# EasyEDA schematic SCH_HackClub-PCB-1_2024-05-19.json
TITLE: Sheet_1; REV: 1.0; Date: 2024-05-09; Sheet: 1/1; Drawn By: noahf15; Company: Your Company
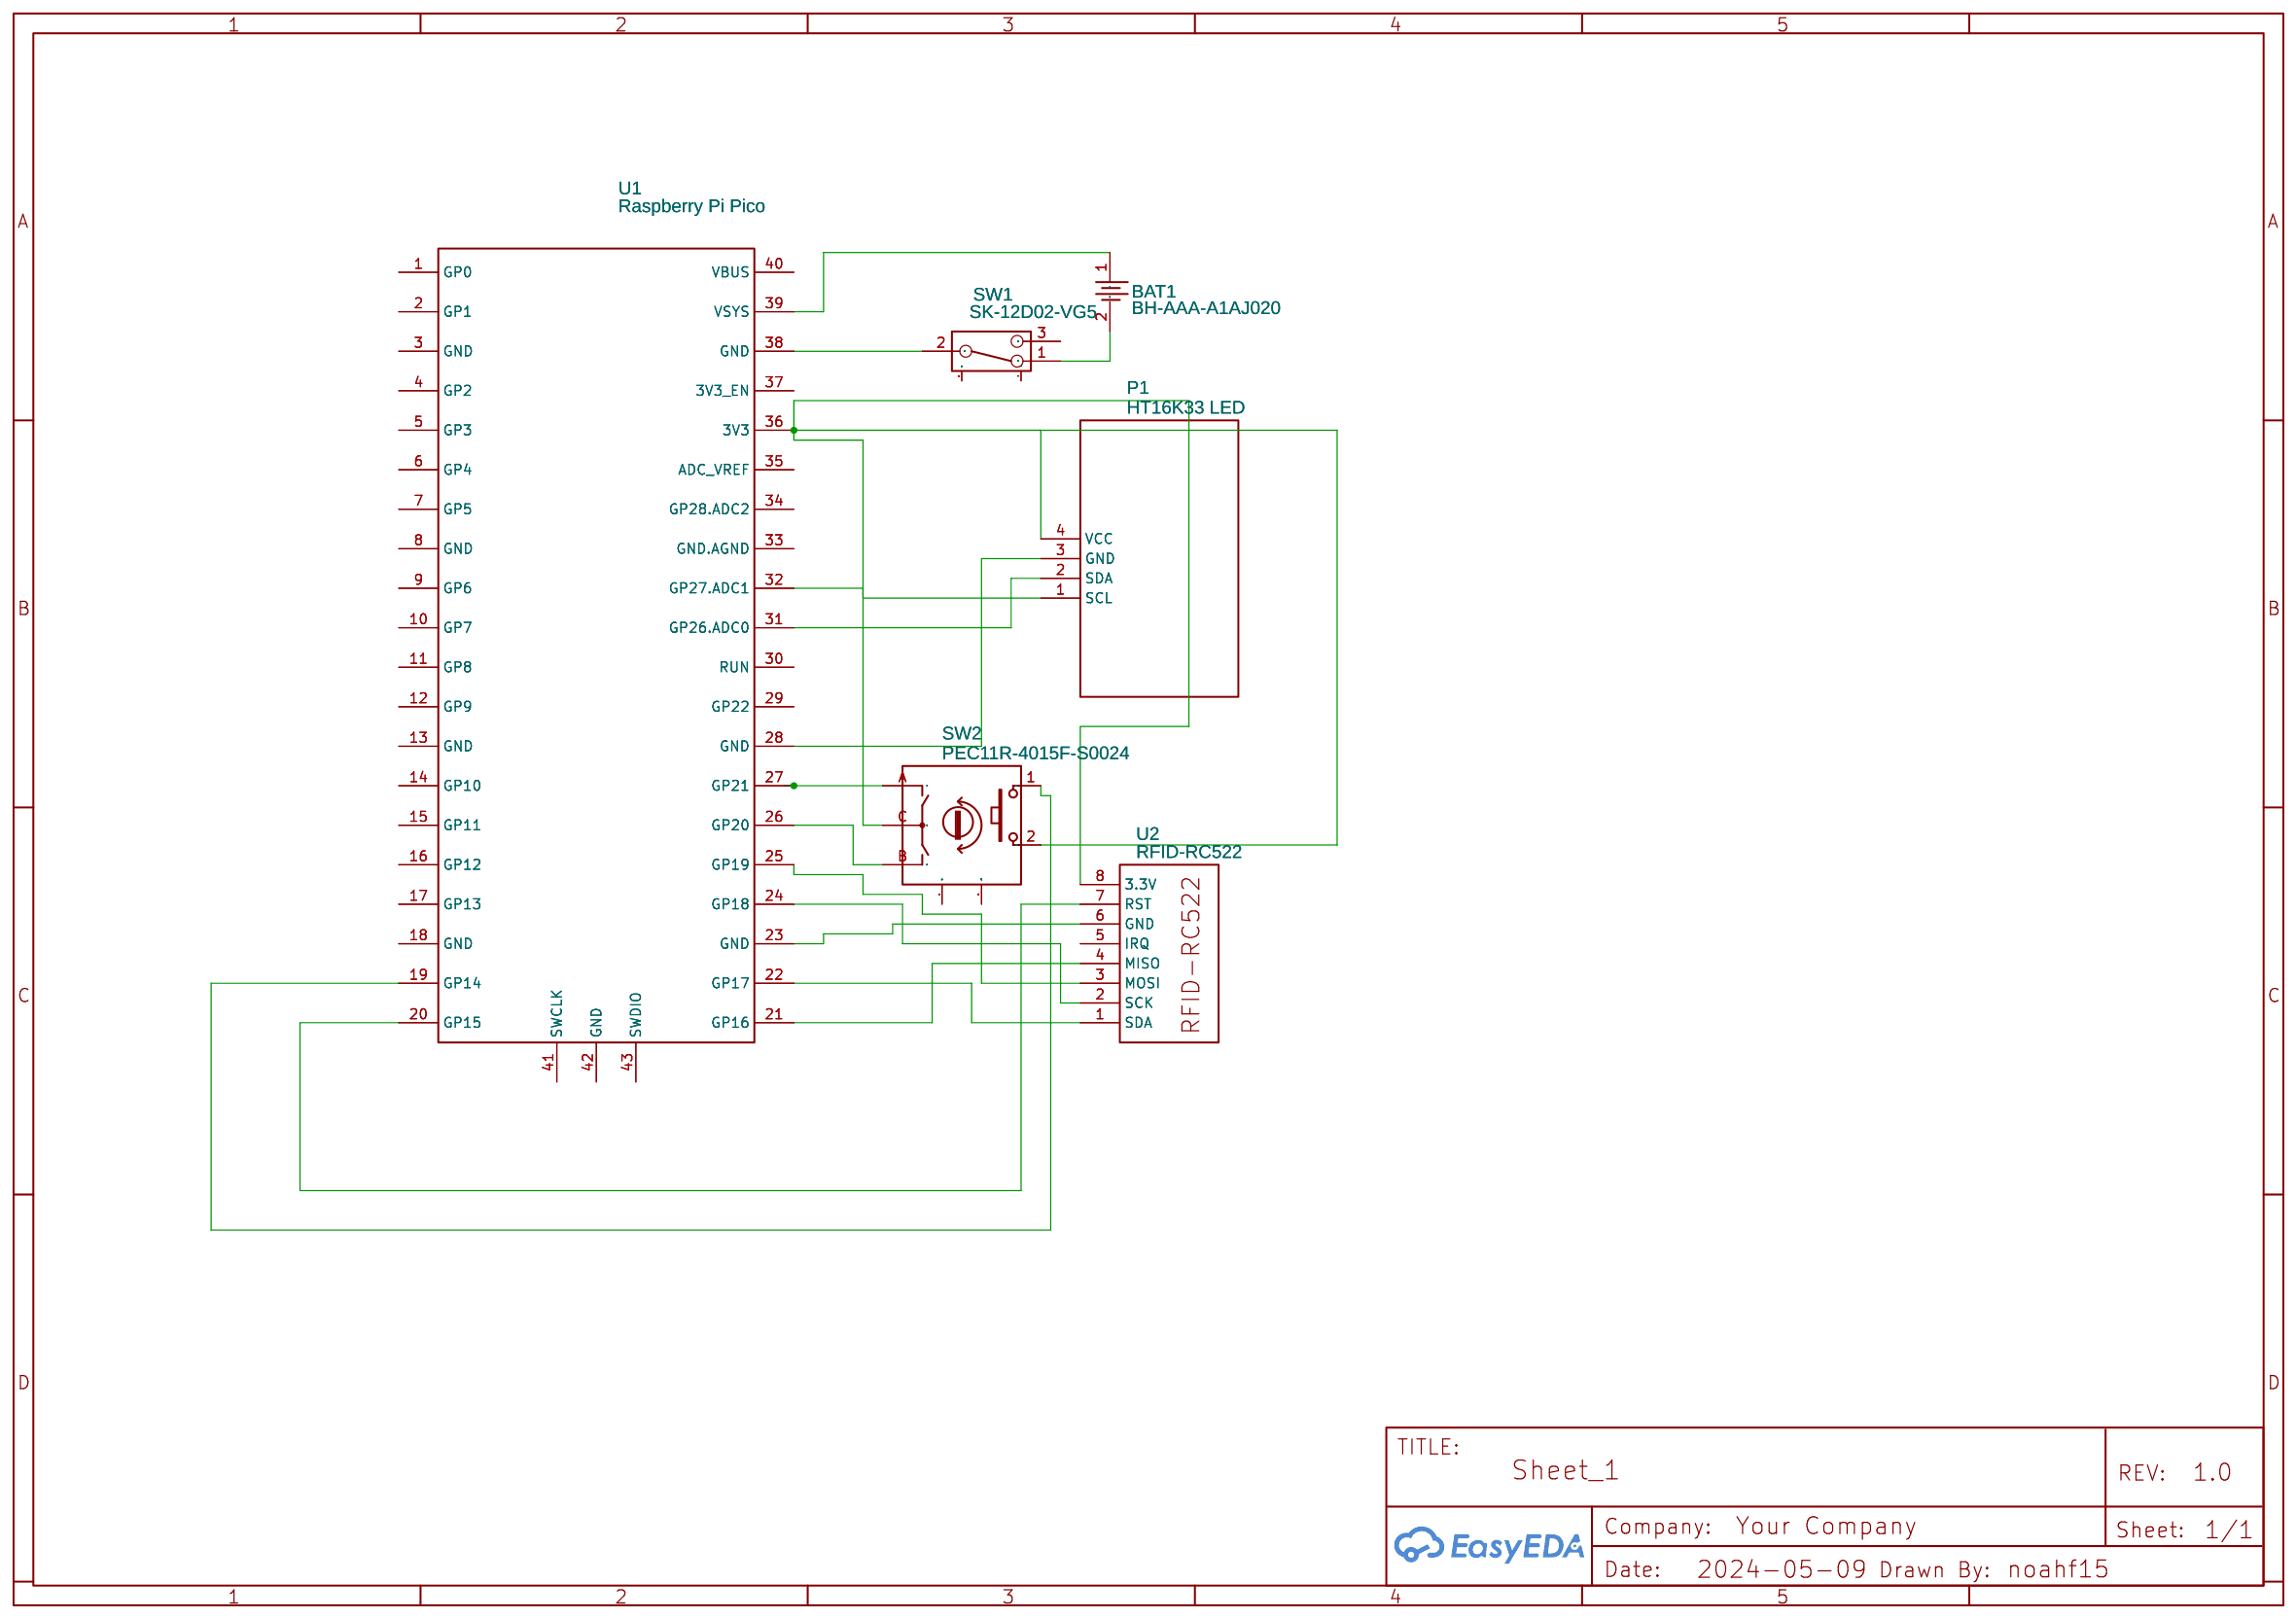
[diagram p0: schematic sheet]

## Parts
BAT1  BH-AAA-A1AJ020  [BAT-TH_BH-BH-AAA-A1AJ020]
P1  HT16K33 LED  [HT16K33 LED]
SW1  SK-12D02-VG5  [SW-TH_SK-12D02VG3]
SW2  PEC11R-4015F-S0024  [SW-TH_PEC11R-4XXXF-SXXXX]
U1  Raspberry Pi Pico  [PICO]
U2  RFID-RC522  [RFID-RC522A]

## Library data of the parts
BAT1 = BH-AAA-A1AJ020: Supplier: LCSC; Supplier Part: C5290191; Manufacturer: MYOUNG(美阳)
P1 = HT16K33 LED: sourceId: 1T5FDZYC8; Contributor: boynegregg312
SW1 = SK-12D02-VG5: Supplier: LCSC; Supplier Part: C136722; Manufacturer: Rectangular Connectors - Contacts; Contributor: LCSC
SW2 = PEC11R-4015F-S0024: Contributor: LCSC; Supplier: LCSC; Supplier Part: C143789; Manufacturer: BOURNS; JLCPCB Part Class: Extended Part
U1 = Raspberry Pi Pico: Manufacturer: Raspberry Pi Foundation; Supplier Part: Pico; Supplier: Digi-Key; Contributor: boynegregg312
U2 = RFID-RC522: Contributor: wokar66

## Nets
Net-(BAT1-1): BAT1.1 U1.39(VSYS)
Net-(BAT1-2): BAT1.2 SW1.1
Net-(P1-1): P1.1(SCL) U1.32(GP27.ADC1)
Net-(P1-2): P1.2(SDA) U1.31(GP26.ADC0)
Net-(P1-3): P1.3(GND) U1.28(GND)
Net-(P1-4): P1.4(VCC) SW2.2 SW2.C U1.36(3V3) U2.8(3.3V)
Net-(SW1-2): SW1.2 U1.38(GND)
Net-(SW2-1): SW2.1 U1.19(GP14)
Net-(SW2-A): SW2.A U1.27(GP21)
Net-(SW2-B): SW2.B U1.26(GP20)
Net-(U1-20): U1.20(GP15) U2.7(RST)
Net-(U1-21): U1.21(GP16) U2.4(MISO)
Net-(U1-22): U1.22(GP17) U2.1(SDA)
Net-(U1-23): U1.23(GND) U2.6(GND)
Net-(U1-24): U1.24(GP18) U2.2(SCK)
Net-(U1-25): U1.25(GP19) U2.3(MOSI)

Not connected (* = marked no-connect by the designer): SW1 3 4 5; SW2 MT1 MT2; U1 1(GP0) 2(GP1) 3(GND) 4(GP2) 5(GP3) 6(GP4) 7(GP5) 8(GND) 9(GP6) 10(GP7) 11(GP8) 12(GP9) 13(GND) 14(GP10) 15(GP11) 16(GP12) 17(GP13) 18(GND) 29(GP22) 30(RUN) 33(GND.AGND) 34(GP28.ADC2) 35(ADC_VREF) 37(3V3_EN) 40(VBUS) 41(SWCLK) 42(GND) 43(SWDIO); U2 5(IRQ)
